# Altium project Squad.PrjPcb (part 2 of 2)

## Sheet DDC.SchDoc
size A4; SheetNumber: 7; SheetTotal: 7
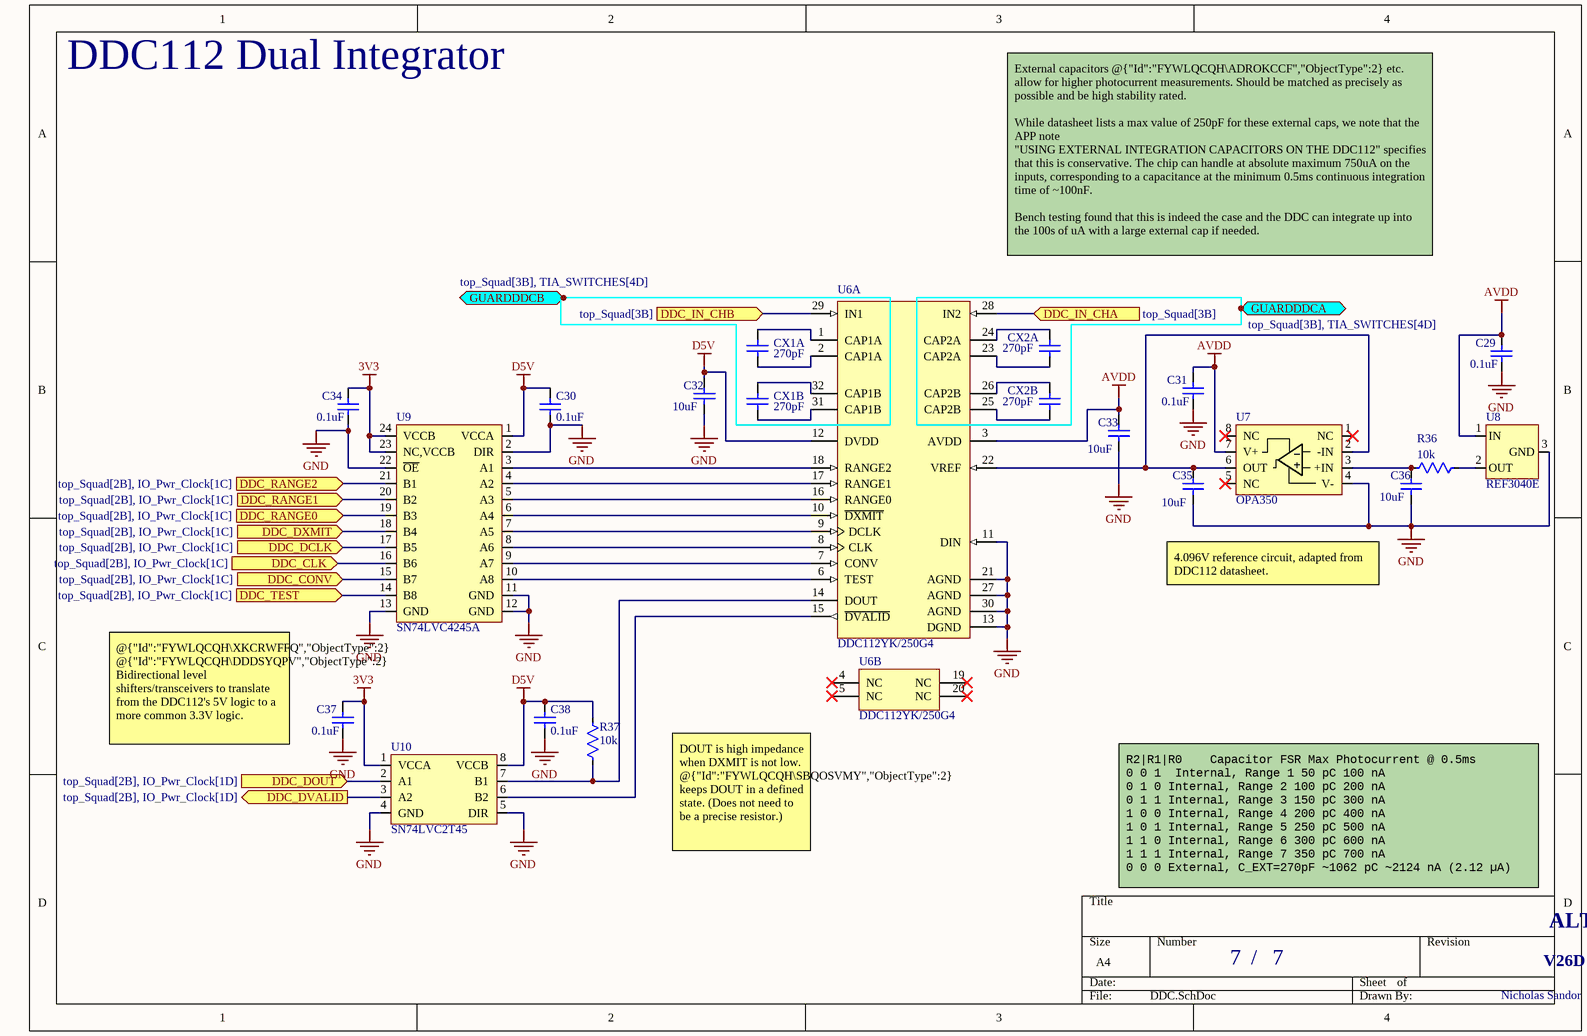
[diagram p6: DDC.SchDoc]

### Parts
C29  0.1uF  [CAP 0603 IPC MID DENSITY]
C30  0.1uF  [CAP 0603 IPC MID DENSITY]
C31  0.1uF  [CAP 0603 IPC MID DENSITY]
C32  10uF  [CAP 0805 IPC MID DENSITY]
C33  10uF  [CAP 0805 IPC MID DENSITY]
C34  0.1uF  [CAP 0603 IPC MID DENSITY]
C35  10uF  [CAP 0805 IPC MID DENSITY]
C36  10uF  [CAP 0805 IPC MID DENSITY]
C37  0.1uF  [CAP 0603 IPC MID DENSITY]
C38  0.1uF  [CAP 0603 IPC MID DENSITY]
CX1A  270pF  [CAP 1206 NON-IPC KEMET NP0]
CX1B  270pF  [CAP 1206 NON-IPC KEMET NP0]
CX2A  270pF  [CAP 1206 NON-IPC KEMET NP0]
CX2B  270pF  [CAP 1206 NON-IPC KEMET NP0]
R36  10k  [RES 0603 IPC MID DENSITY]
R37  10k  [RES 0603 IPC MID DENSITY]
U6  DDC112YK/250G4  [TI-PJT32_N]  (parts A,B of 2)
U7  OPA350  [8VSSOP LOW DENSITY TI]
U8  REF3040E  [SOT23-3 MID DENSITY TI]
U9  SN74LVC4245A  [24TSSOP LOW DENSITY TI]
U10  SN74LVC2T45  [DCU8-L]

### Ports
DDC_CLK (in, see top_Squad[2B], IO_Pwr_Clock[1C]), DDC_CONV (in, see top_Squad[2B], IO_Pwr_Clock[1C]), DDC_DCLK (in, see top_Squad[2B], IO_Pwr_Clock[1C]), DDC_DOUT (in, see top_Squad[2B], IO_Pwr_Clock[1D]), DDC_DVALID (out, see top_Squad[2B], IO_Pwr_Clock[1D]), DDC_DXMIT (in, see top_Squad[2B], IO_Pwr_Clock[1C]), DDC_IN_CHA (in, see top_Squad[3B]), DDC_IN_CHB (in, see top_Squad[3B]), DDC_RANGE0 (in, see top_Squad[2B], IO_Pwr_Clock[1C]), DDC_RANGE1 (in, see top_Squad[2B], IO_Pwr_Clock[1C]), DDC_RANGE2 (in, see top_Squad[2B], IO_Pwr_Clock[1C]), DDC_TEST (in, see top_Squad[2B], IO_Pwr_Clock[1C]), GUARDDDCA (bidir, see top_Squad[3B], TIA_SWITCHES[4D]), GUARDDDCB (bidir, see top_Squad[3B], TIA_SWITCHES[4D])

### Nets
3V3: C34.1 C37.1 U9.23(NC,VCCB) U9.24(VCCB) U10.1(VCCA)
AVDD: C29.2 C31.2 C33.1 U6.3(AVDD) U7.7(V+) U8.1(IN)
D5V: C30.1 C32.1 C38.1 R37.2 U6.12(DVDD) U9.1(VCCA) U10.8(VCCB)
GND: C29.1 C30.2 C31.1 C32.2 C33.2 C34.2 C35.2 C36.2 C37.2 C38.2 U6.11(DIN) U6.13(DGND) U6.21(AGND) U6.27(AGND) U6.30(AGND) U7.4(V-) U8.3(GND) U9.2(DIR) U9.11(GND) U9.12(GND) U9.13(GND) U9.22(~{OE}) U10.4(GND) U10.5(DIR)  [project net SYS_GND]
DDC_CLK: U9.16(B6) ; port DDC_CLK
DDC_CONV: U9.15(B7) ; port DDC_CONV
DDC_DCLK: U9.17(B5) ; port DDC_DCLK
DDC_DOUT: U10.2(A1) ; port DDC_DOUT
DDC_DVALID: U10.3(A2) ; port DDC_DVALID
DDC_DXMIT: U9.18(B4) ; port DDC_DXMIT
DDC_RANGE0: U9.19(B3) ; port DDC_RANGE0
DDC_RANGE1: U9.20(B2) ; port DDC_RANGE1
DDC_RANGE2: U9.21(B1) ; port DDC_RANGE2
DDC_TEST: U9.14(B8) ; port DDC_TEST
GUARD: port GUARDDDCB, port GUARDDDCA
NetC35_1: C35.1 U6.22(VREF) U7.2(-IN) U7.6(OUT)
NetC36_1: C36.1 R36.1 U7.3(+IN)
NetCX1A_1: CX1A.1 U6.2(CAP1A)
NetCX1A_2: CX1A.2 U6.1(CAP1A)
NetCX1B_1: CX1B.1 U6.31(CAP1B)
NetCX1B_2: CX1B.2 U6.32(CAP1B)
NetCX2A_1: CX2A.1 U6.23(CAP2A)
NetCX2A_2: CX2A.2 U6.24(CAP2A)
NetCX2B_1: CX2B.1 U6.25(CAP2B)
NetCX2B_2: CX2B.2 U6.26(CAP2B)
NetK1_4: U6.29(IN1) ; port DDC_IN_CHB
NetK1_5: U6.28(IN2) ; port DDC_IN_CHA
NetR36_2: R36.2 U8.2(OUT)
NetR37_1: R37.1 U6.14(DOUT) U10.7(B1)
NetU6_6: U6.6(TEST) U9.10(A8)
NetU6_7: U6.7(CONV) U9.9(A7)
NetU6_8: U6.8(CLK) U9.8(A6)
NetU6_9: U6.9(DCLK) U9.7(A5)
NetU6_10: U6.10(~{DXMIT}) U9.6(A4)
NetU6_15: U6.15(~{DVALID}) U10.6(B2)
NetU6_16: U6.16(RANGE0) U9.5(A3)
NetU6_17: U6.17(RANGE1) U9.4(A2)
NetU6_18: U6.18(RANGE2) U9.3(A1)

Not connected (* = marked no-connect by the designer): U6 4(NC)* 5(NC)* 19(NC)* 20(NC)*; U7 1(NC)* 5(NC)* 8(NC)*

### Notes on the sheet
- DDC112 Dual Integrator
- External capacitors @{"Id":"FYWLQCQH\ADROKCCF","ObjectType":2} etc. allow for higher photocurrent measurements. Should be matched as precisely as possible and be high stability rated.
  While datasheet lists a max value of 250pF for these external caps, we note that the APP note
  "USING EXTERNAL INTEGRATION CAPACITORS ON THE DDC112" specifies that this is conservative. The chip can handle at absolute maximum 750uA on the inputs, corresponding to a capacitance at the minimum 0.5ms continuous integration time of ~100nF.
  Bench testing found that this is indeed the case and the DDC can integrate up into the 100s of uA with a large external cap if needed.
- 4.096V reference circuit, adapted from DDC112 datasheet.
- (near C37) @{"Id":"FYWLQCQH\XKCRWFFQ","ObjectType":2} @{"Id":"FYWLQCQH\DDDSYQPV","ObjectType":2} Bidirectional level shifters/transceivers to translate from the DDC112's 5V logic to a more common 3.3V logic.
  Parts chosen based on DDC112EVM by TI.
- DOUT is high impedance when DXMIT is not low. @{"Id":"FYWLQCQH\SBQOSVMY","ObjectType":2} keeps DOUT in a defined state. (Does not need to be a precise resistor.)
- R2|R1|R0   	Capacitor	FSR	Max Photocurrent @ 0.5ms
  0 0 1 	Internal, Range 1	50 pC	100 nA
  0 1 0	Internal, Range 2	100 pC	200 nA
  0 1 1	Internal, Range 3	150 pC	300 nA
  1 0 0	Internal, Range 4	200 pC	400 nA
  1 0 1	Internal, Range 5	250 pC	500 nA
  1 1 0	Internal, Range 6	300 pC	600 nA
  1 1 1	Internal, Range 7	350 pC	700 nA
  0 0 0	External, C_EXT=270pF	~1062 pC	~2124 nA (2.12 µA)
- /
- ALTAIR PhotoDiode ReadOut (PDRO) - Squad

### Library data of the parts
C29-C31 C34 C37 C38 = CAP: Kemet C0603C104K5RACAUTO - Cap Ceramic 0.1uF 50V X7R 10% 0603 125C Paper T/R; MF: KEMET; MP: C0603C104K5RACAUTO
C32 C33 C35 C36 = CAP: Murata GRM21BR61E106KA73L - Cap Ceramic 10uF 10% 25V X5R 0805; MF: Murata; MP: GRM21BR61E106KA73L
CX1A CX1B CX2A CX2B = CAP: Yageo CC1206FRNPO9BN271 - Cap Ceramic 270pF 1% C0G/NP0 50V SMD 1206; MF: YAGEO; MP: CC1206FRNPO9BN271
R36 R37 = RES: Res, Any, Manually select footprint; MF: Panasonic Industry; MP: ERJ-3AEB103V
U6 = CMP-0003-01894-1: Dual Current Input 20-Bit ADC, 0 to 70 degC, 32-pin QFP (PJT32), Green (RoHS & no Sb/Br); Manufacturer: Texas Instruments; SubFamily: Current Input ADC; Digital Supply(Max)(V): 5.25; Resolution(Bits): 20; Sample Rate (max)(SPS): 3k; # Input Channels: 2; Architecture: Delta-Sigma; Analog Voltage AV/DD(Min)(V): 4.75; PartNumber: DDC112YK/250G4; Code_JEDEC: MS-026; ComponentLink2URL: http://www.ti.com/general/docs/lit/getliterature.tsp?genericPartNumber=DDC112&fileType=pdf; ComponentLink1Description: Manufacturer URL; PackageVersion: 4203540/A, 11/2001; ComponentLink2Description: Datasheet; Eco-Plan: Green (RoHS & no Sb/Br); ComponentLink3URL: http://www.ti.com/litv/pdf/mpqf112; PackageDescription: 32-Pin Plastic Quad Flatpack, Body 7 x 7 mm, Pitch 0.8 mm; DatasheetVersion: SBAS085B; PackageReference: PJT32; Analog Voltage AV/DD(Max)(V): 5.25; Mounting Technology: Surface Mount; ComponentLink3Description: Package Specification; Digital Supply(Min)(V): 4.75; ComponentLink1URL: http://www.ti.com/
U7 = OPA350EA: High-Speed Single-Supply Rail-to-Rail Op Amp, MicroAmplifier Series, 8VSSOP; MF: Texas Instruments; MP: OPA350EA/2K5
U8 = REF3040EAIDBZR: Low-Drift Low-Power Series Voltage Reference 4.096V SOT23-3; MF: Texas Instruments; MP: REF3040EAIDBZR
U9 = SN74LVC4245A: Octal Bus Transceiver and 3.3V to 5V Shifter with Tri-State Outputs 24TSSOP; MF: Texas Instruments; MP: SN74LVC4245APWR
U10 = SN74LVC2T45: Dual-Bit Dual-Supply Bus Transceiver With Configurable Voltage Translation 8VSSOP; MF: Texas Instruments; MP: SN74LVC2T45DCUR

## Nets that join several sheets
3V3: IO_Pwr_Clock (R40.2 R46.1 U12.2), ADC (6 pins), DDC (5 pins)
AVDD: Power (C48.1 TP10.1 U15.4 U15.5), TIA_SWITCHES (6 pins), A (C50A.2 C51A.2 U16A.4), B (C50B.2 C51B.2 U16B.4), DDC (6 pins)
AVDD_ADC: Power (C46.1 TP9.1 U14.4 U14.5), ADC (C21.2 U5.26), TIA_SWITCHES (R53.1), A (R54A.1), B (R54B.1)
AVSS: Power (C44.2 R49.2 TP8.1 U13.5), TIA_SWITCHES (10 pins)
D5V: Power (C41.2 R47.2 TP7.1 U13.12), TIA_SWITCHES (C9.2 U4.5), DDC (7 pins)
SYS_GND: Power (17 pins), IO_Pwr_Clock (13 pins), ADC (19 pins), TIA_SWITCHES (26 pins), A (9 pins), B (9 pins), DDC (24 pins)
~{DRDY}: IO_Pwr_Clock (J1.16), ADC (R31.2)
~{SPI_CS_ADC}: IO_Pwr_Clock (J1.20), ADC (U5.9)
ADC_RESET: IO_Pwr_Clock (R45.2 R46.2), ADC (U5.18)
BRD_TMP_ADCIN: ADC (U5.22), TIA_SWITCHES (C8.2 R53.2 RT1.2)
DDC_CLK: IO_Pwr_Clock (J1.15), DDC (U9.16)
DDC_CONV: IO_Pwr_Clock (J1.17), DDC (U9.15)
DDC_DCLK: IO_Pwr_Clock (J1.13), DDC (U9.17)
DDC_DOUT: IO_Pwr_Clock (J1.23), DDC (U10.2)
DDC_DVALID: IO_Pwr_Clock (J1.21), DDC (U10.3)
DDC_DXMIT: IO_Pwr_Clock (J1.11), DDC (U9.18)
DDC_RANGE0: IO_Pwr_Clock (J1.09), DDC (U9.19)
DDC_RANGE1: IO_Pwr_Clock (J1.07), DDC (U9.20)
DDC_RANGE2: IO_Pwr_Clock (J1.05), DDC (U9.21)
DDC_TEST: IO_Pwr_Clock (J1.19), DDC (U9.14)
GUARD: A (J2A.4 R52A.1), B (J2B.4 R52B.1)
LEDCONTROL_GPIO: IO_Pwr_Clock (Q5.1 R42.2), ADC (U5.19)
NetK1_4: TIA_SWITCHES (K1.4), DDC (U6.29)
NetK1_5: TIA_SWITCHES (K1.5), DDC (U6.28)
NetR1_2: ADC (R32.1 TP3.1), TIA_SWITCHES (R1.2 U2.14)
NetR3_2: ADC (R30.1 TP2.1), TIA_SWITCHES (R3.2 U2.8)
NetR8_2: ADC (R28.1 TP1.1), TIA_SWITCHES (R8.2 U1.14)
NetR14_2: ADC (R35.1 TP6.1), TIA_SWITCHES (R14.2 U2.7)
NetR16_2: ADC (R34.1 TP5.1), TIA_SWITCHES (R16.2 U2.1)
NetR21_2: ADC (R33.1 TP4.1), TIA_SWITCHES (R21.2 U3.8)
PD_A: TIA_SWITCHES (K1.6), A (J2A.2)
PD_A: TIA_SWITCHES (K1.3), B (J2B.2)
PD_K: ADC (U5.31), A (5 pins)
PD_K: ADC (U5.32), B (5 pins)
PDA_TMP_ADCIN: ADC (U5.20), A (J2A.3 R54A.2)
PDB_TMP_ADCIN: ADC (U5.21), B (J2B.3 R54B.2)
RELAY_A: IO_Pwr_Clock (J1.03), TIA_SWITCHES (U4.1)
RELAY_B: IO_Pwr_Clock (J1.01), TIA_SWITCHES (U4.2)
rSPI_MOSI: IO_Pwr_Clock (R44.2), ADC (U5.10), A (U16A.3), B (U16B.3)
rSPI_SCLK: IO_Pwr_Clock (R43.2), ADC (U5.11), A (U16A.2), B (U16B.2)
SPI_CS_DAC_CHA: IO_Pwr_Clock (J1.08), A (U16A.1)
SPI_CS_DAC_CHB: IO_Pwr_Clock (J1.10), B (U16B.1)
SPI_MISO: IO_Pwr_Clock (J1.22), ADC (R29.2)
STRT: IO_Pwr_Clock (J1.18), ADC (U5.8)
SYS_VBAT_RB: Power (10 pins), IO_Pwr_Clock (R38.2 U11.2)